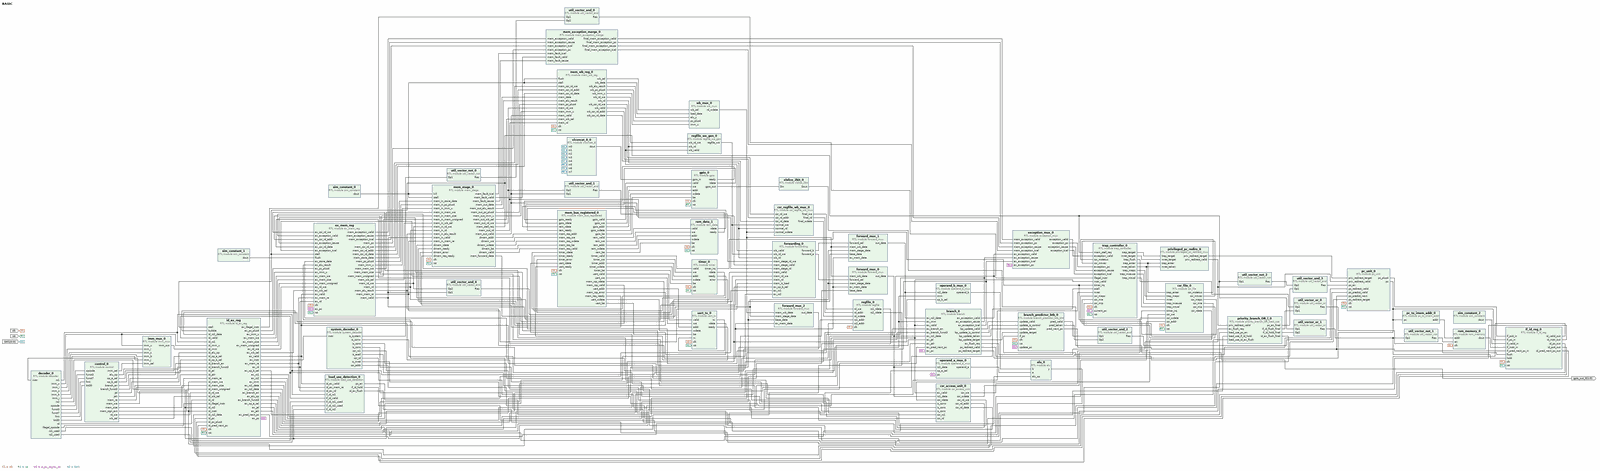
[diagram p0: block diagram of the top level, whole]
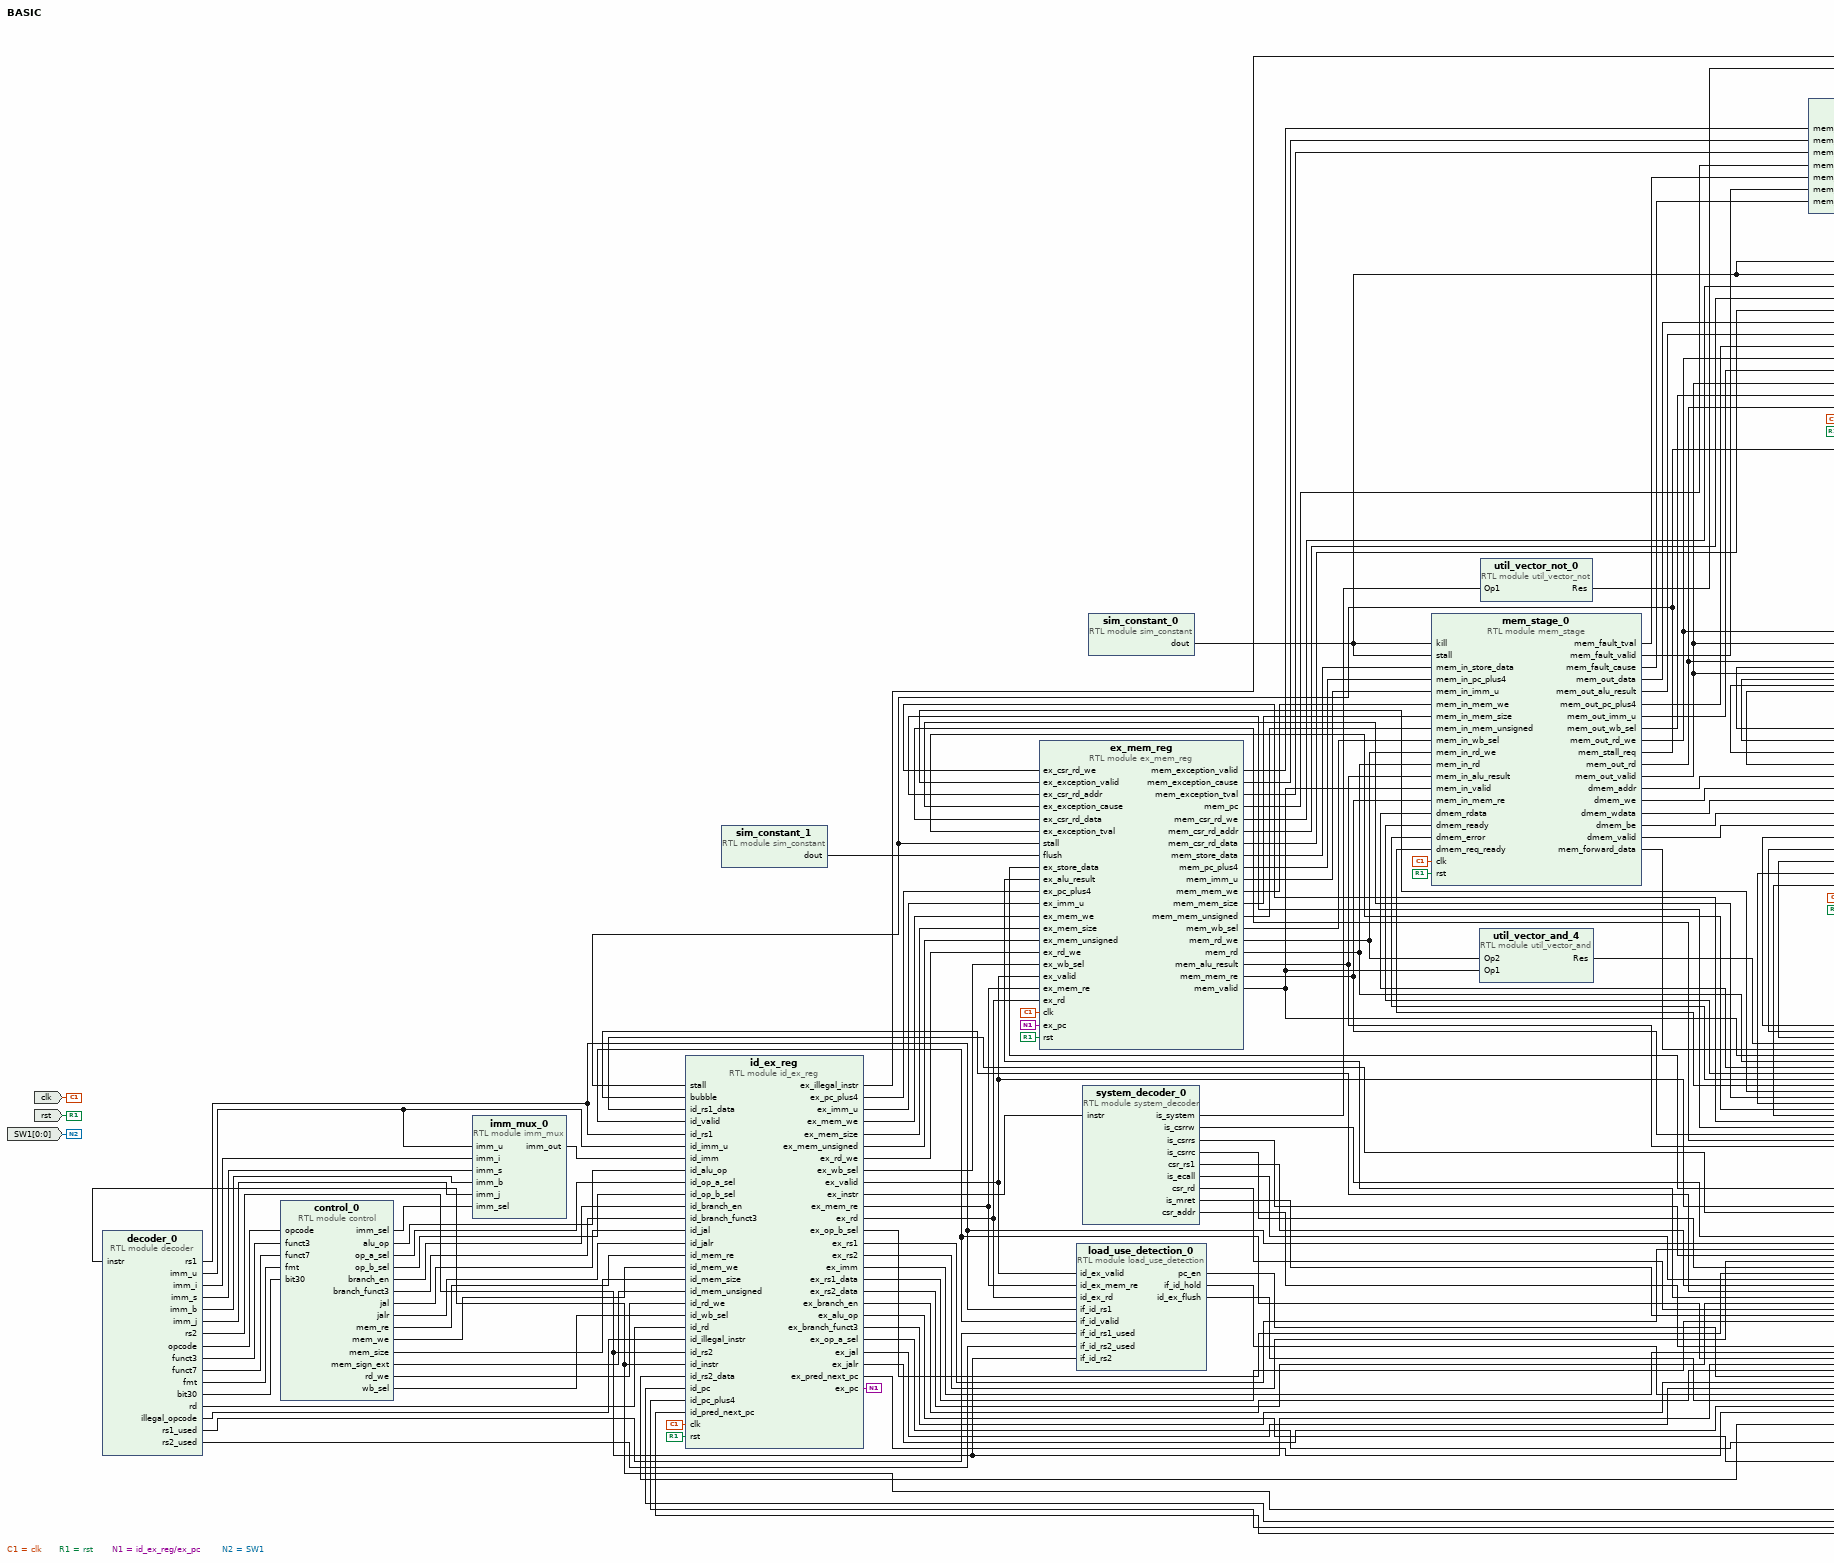
[diagram p1: block diagram of the top level, left part]
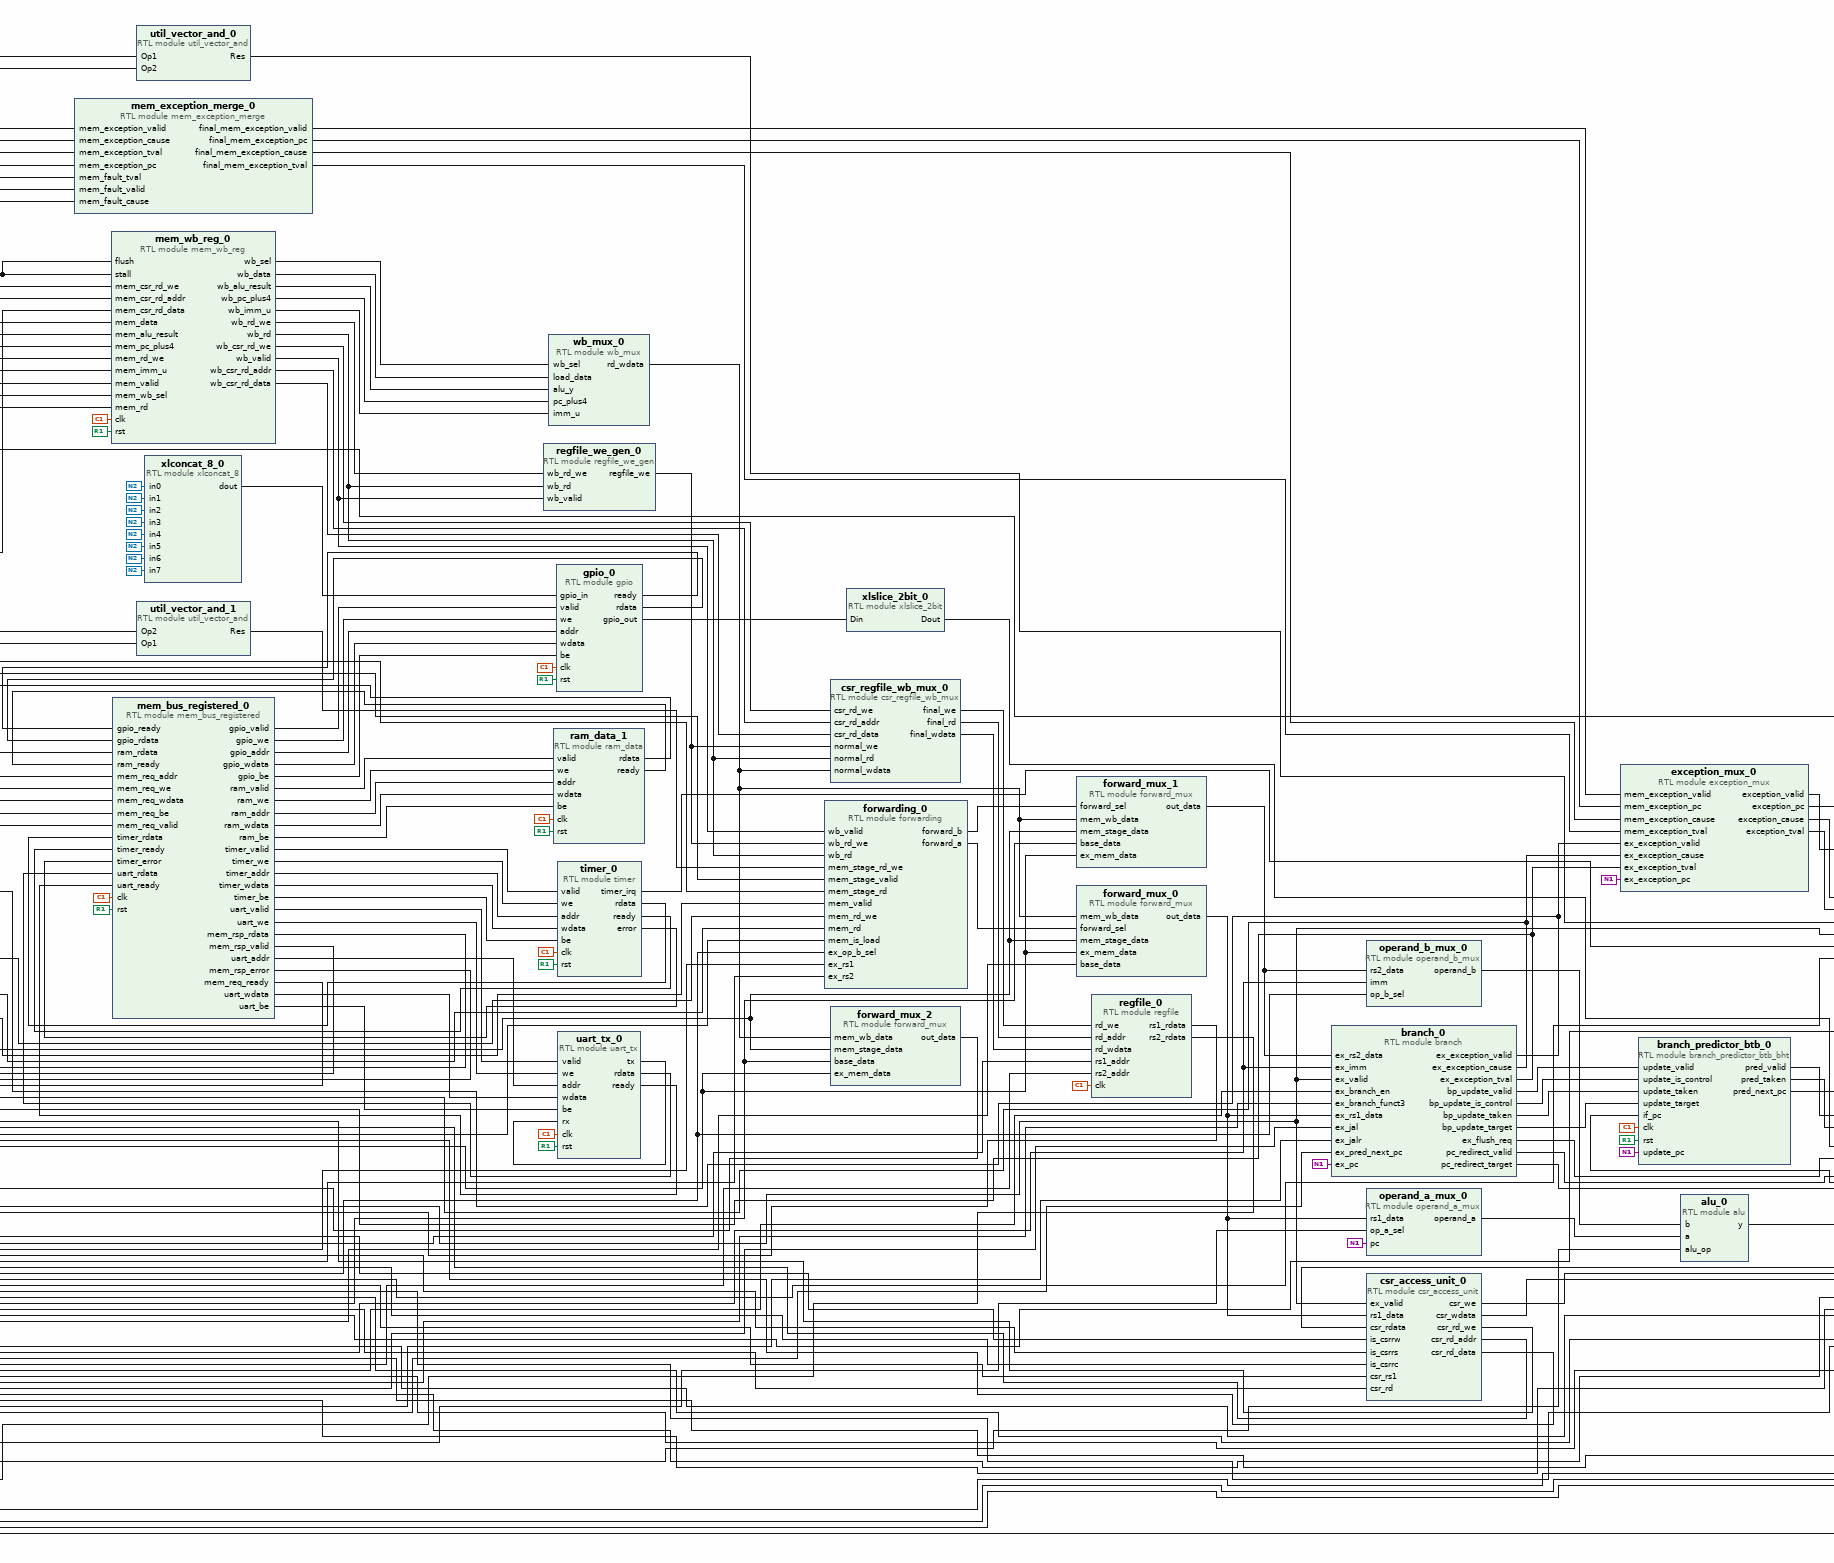
[diagram p2: block diagram of the top level, centre part]
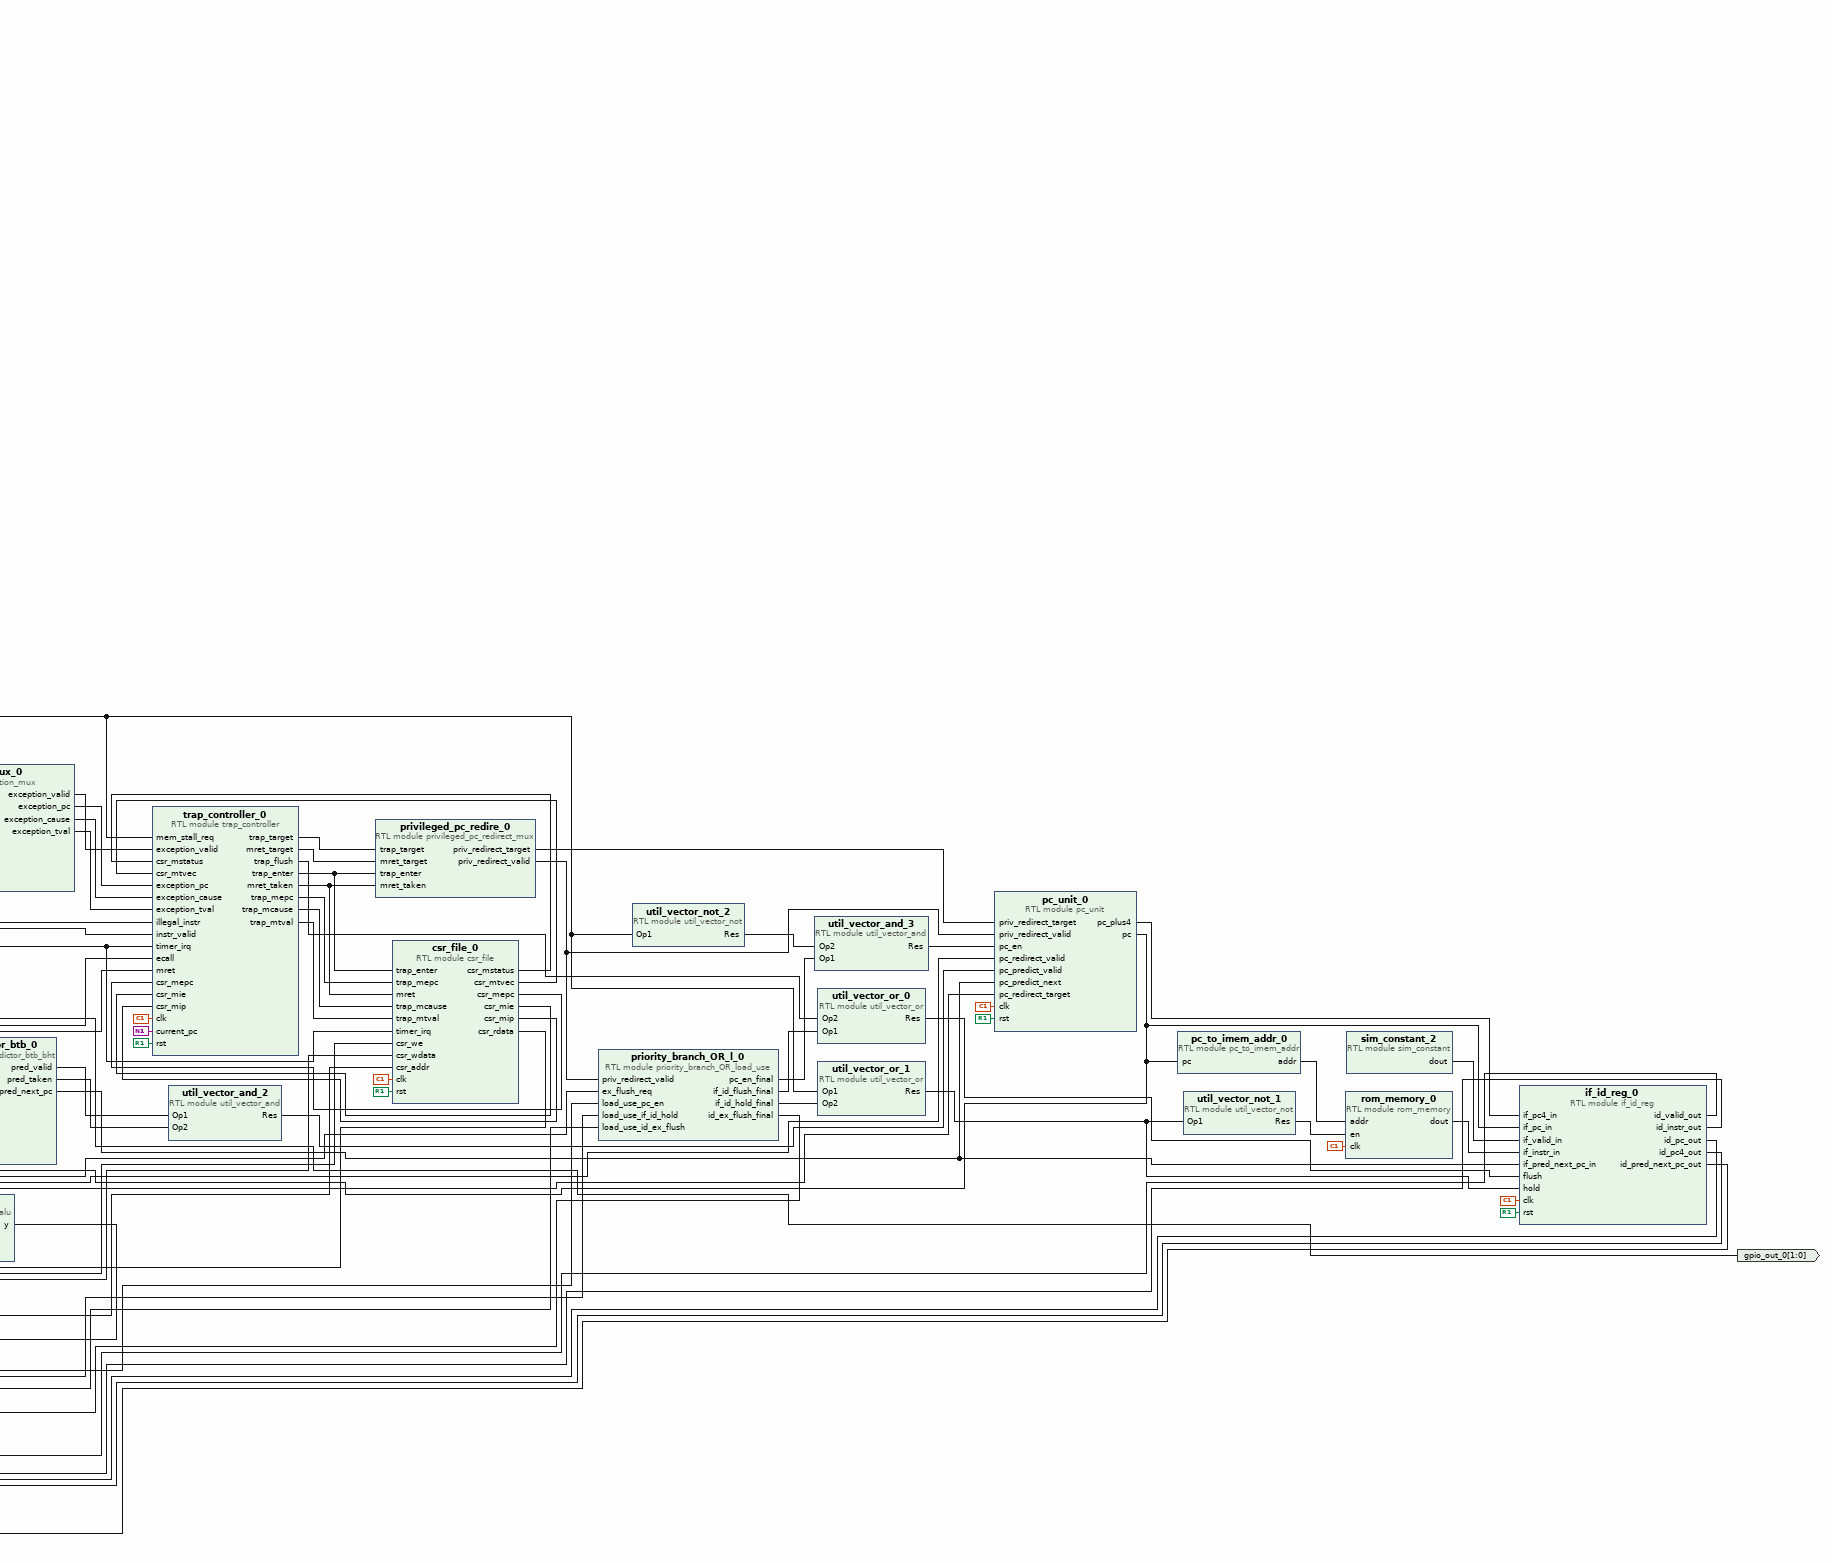
[diagram p3: block diagram of the top level, right part]
# Vivado block design BASIC, xczu5ev-sfvc784-2-i, Vivado 2020.1
create_bd_design BASIC

create_bd_port -dir O -from 1 -to 0 gpio_out_0
create_bd_port -dir I -from 0 -to 0 SW1
create_bd_port -dir I -type clk clk
set_property -dict {CONFIG.FREQ_HZ 100000000} [get_bd_ports clk]
create_bd_port -dir I rst

create_bd_cell -type module -reference xlslice_2bit xlslice_2bit_0
create_bd_cell -type module -reference xlconcat_8 xlconcat_8_0
create_bd_cell -type module -reference uart_tx uart_tx_0
set_property -dict {CONFIG.BAUD 115200 CONFIG.CLK_FREQ 190474289} [get_bd_cells uart_tx_0]
create_bd_cell -type module -reference timer timer_0
set_property -dict {CONFIG.RESET_CMP 0x0002E7CA} [get_bd_cells timer_0]
create_bd_cell -type module -reference gpio gpio_0
create_bd_cell -type module -reference ram_data ram_data_1
create_bd_cell -type module -reference mem_bus_registered mem_bus_registered_0
create_bd_cell -type module -reference csr_access_unit csr_access_unit_0
create_bd_cell -type module -reference privileged_pc_redirect_mux privileged_pc_redire_0
create_bd_cell -type module -reference system_decoder system_decoder_0
create_bd_cell -type module -reference csr_file csr_file_0
create_bd_cell -type module -reference csr_regfile_wb_mux csr_regfile_wb_mux_0
create_bd_cell -type module -reference trap_controller trap_controller_0
create_bd_cell -type module -reference exception_mux exception_mux_0
create_bd_cell -type module -reference mem_exception_merge mem_exception_merge_0
create_bd_cell -type module -reference util_vector_and util_vector_and_0
create_bd_cell -type module -reference util_vector_not util_vector_not_0
create_bd_cell -type module -reference load_use_detection load_use_detection_0
create_bd_cell -type module -reference priority_branch_OR_load_use priority_branch_OR_l_0
create_bd_cell -type module -reference regfile_we_gen regfile_we_gen_0
create_bd_cell -type module -reference mem_wb_reg mem_wb_reg_0
create_bd_cell -type module -reference mem_stage mem_stage_0
create_bd_cell -type module -reference sim_constant sim_constant_0
create_bd_cell -type module -reference alu alu_0
create_bd_cell -type module -reference operand_b_mux operand_b_mux_0
create_bd_cell -type module -reference operand_a_mux operand_a_mux_0
create_bd_cell -type module -reference forward_mux forward_mux_0
create_bd_cell -type module -reference forward_mux forward_mux_1
create_bd_cell -type module -reference forward_mux forward_mux_2
create_bd_cell -type module -reference forwarding forwarding_0
create_bd_cell -type module -reference branch branch_0
create_bd_cell -type module -reference ex_mem_reg ex_mem_reg
create_bd_cell -type module -reference sim_constant sim_constant_1
create_bd_cell -type module -reference util_vector_and util_vector_and_4
create_bd_cell -type module -reference util_vector_and util_vector_and_1
create_bd_cell -type module -reference regfile regfile_0
create_bd_cell -type module -reference imm_mux imm_mux_0
create_bd_cell -type module -reference id_ex_reg id_ex_reg
create_bd_cell -type module -reference decoder decoder_0
create_bd_cell -type module -reference control control_0
create_bd_cell -type module -reference pc_to_imem_addr pc_to_imem_addr_0
set_property -dict {CONFIG.ADDR_W 11} [get_bd_cells pc_to_imem_addr_0]
create_bd_cell -type module -reference branch_predictor_btb_bht branch_predictor_btb_0
create_bd_cell -type module -reference pc_unit pc_unit_0
create_bd_cell -type module -reference util_vector_or util_vector_or_0
create_bd_cell -type module -reference util_vector_or util_vector_or_1
create_bd_cell -type module -reference util_vector_and util_vector_and_2
create_bd_cell -type module -reference util_vector_not util_vector_not_2
create_bd_cell -type module -reference util_vector_not util_vector_not_1
create_bd_cell -type module -reference util_vector_and util_vector_and_3
create_bd_cell -type module -reference rom_memory rom_memory_0
create_bd_cell -type module -reference wb_mux wb_mux_0
create_bd_cell -type module -reference sim_constant sim_constant_2
set_property -dict {CONFIG.VALUE 1} [get_bd_cells sim_constant_2]
create_bd_cell -type module -reference if_id_reg if_id_reg_0

# ---- connections ----

connect_bd_net -net zynq_ultra_ps_e_0_pl_clk0 [get_bd_ports clk] \
  [get_bd_pins uart_tx_0/clk] [get_bd_pins timer_0/clk] [get_bd_pins gpio_0/clk] [get_bd_pins ram_data_1/clk] \
  [get_bd_pins mem_bus_registered_0/clk] [get_bd_pins csr_file_0/clk] [get_bd_pins trap_controller_0/clk] \
  [get_bd_pins mem_wb_reg_0/clk] [get_bd_pins mem_stage_0/clk] [get_bd_pins ex_mem_reg/clk] [get_bd_pins regfile_0/clk] \
  [get_bd_pins id_ex_reg/clk] [get_bd_pins branch_predictor_btb_0/clk] [get_bd_pins pc_unit_0/clk] \
  [get_bd_pins rom_memory_0/clk] [get_bd_pins if_id_reg_0/clk]
connect_bd_net -net proc_sys_reset_0_peripheral_reset [get_bd_ports rst] \
  [get_bd_pins uart_tx_0/rst] [get_bd_pins timer_0/rst] [get_bd_pins gpio_0/rst] [get_bd_pins ram_data_1/rst] \
  [get_bd_pins mem_bus_registered_0/rst] [get_bd_pins csr_file_0/rst] [get_bd_pins trap_controller_0/rst] \
  [get_bd_pins mem_wb_reg_0/rst] [get_bd_pins mem_stage_0/rst] [get_bd_pins ex_mem_reg/rst] [get_bd_pins id_ex_reg/rst] \
  [get_bd_pins branch_predictor_btb_0/rst] [get_bd_pins pc_unit_0/rst] [get_bd_pins if_id_reg_0/rst]
connect_bd_net -net RV32I_MEM_dmem_addr [get_bd_pins mem_stage_0/dmem_addr] [get_bd_pins mem_bus_registered_0/mem_req_addr]
connect_bd_net -net RV32I_MEM_dmem_we [get_bd_pins mem_stage_0/dmem_we] [get_bd_pins mem_bus_registered_0/mem_req_we]
connect_bd_net -net RV32I_MEM_dmem_wdata [get_bd_pins mem_stage_0/dmem_wdata] [get_bd_pins mem_bus_registered_0/mem_req_wdata]
connect_bd_net -net RV32I_MEM_dmem_be [get_bd_pins mem_stage_0/dmem_be] [get_bd_pins mem_bus_registered_0/mem_req_be]
connect_bd_net -net RV32I_RAM_MEMORY_rdata [get_bd_pins ram_data_1/rdata] [get_bd_pins mem_bus_registered_0/ram_rdata]
connect_bd_net [get_bd_pins gpio_0/gpio_out] [get_bd_pins xlslice_2bit_0/Din]
connect_bd_net [get_bd_pins uart_tx_0/rdata] [get_bd_pins mem_bus_registered_0/uart_rdata]
connect_bd_net [get_bd_pins gpio_0/ready] [get_bd_pins mem_bus_registered_0/gpio_ready]
connect_bd_net [get_bd_pins gpio_0/rdata] [get_bd_pins mem_bus_registered_0/gpio_rdata]
connect_bd_net [get_bd_pins timer_0/rdata] [get_bd_pins mem_bus_registered_0/timer_rdata]
connect_bd_net [get_bd_pins timer_0/ready] [get_bd_pins mem_bus_registered_0/timer_ready]
connect_bd_net -net mem_data_1 [get_bd_pins mem_bus_registered_0/mem_rsp_rdata] [get_bd_pins mem_stage_0/dmem_rdata]
connect_bd_net -net MMIO_ram_valid [get_bd_pins mem_bus_registered_0/ram_valid] [get_bd_pins ram_data_1/valid]
connect_bd_net -net we_1 [get_bd_pins mem_bus_registered_0/ram_we] [get_bd_pins ram_data_1/we]
connect_bd_net -net addr_1 [get_bd_pins mem_bus_registered_0/ram_addr] [get_bd_pins ram_data_1/addr]
connect_bd_net -net wdata_1 [get_bd_pins mem_bus_registered_0/ram_wdata] [get_bd_pins ram_data_1/wdata]
connect_bd_net -net be_1 [get_bd_pins mem_bus_registered_0/ram_be] [get_bd_pins ram_data_1/be]
connect_bd_net -net valid_1 [get_bd_pins mem_bus_registered_0/gpio_valid] [get_bd_pins gpio_0/valid]
connect_bd_net -net we_2 [get_bd_pins mem_bus_registered_0/gpio_we] [get_bd_pins gpio_0/we]
connect_bd_net -net addr_2 [get_bd_pins mem_bus_registered_0/gpio_addr] [get_bd_pins gpio_0/addr]
connect_bd_net -net wdata_2 [get_bd_pins mem_bus_registered_0/gpio_wdata] [get_bd_pins gpio_0/wdata]
connect_bd_net -net be_2 [get_bd_pins mem_bus_registered_0/gpio_be] [get_bd_pins gpio_0/be]
connect_bd_net -net valid_2 [get_bd_pins mem_bus_registered_0/uart_valid] [get_bd_pins uart_tx_0/valid]
connect_bd_net -net we_3 [get_bd_pins mem_bus_registered_0/uart_we] [get_bd_pins uart_tx_0/we]
connect_bd_net -net addr_3 [get_bd_pins mem_bus_registered_0/uart_addr] [get_bd_pins uart_tx_0/addr]
connect_bd_net -net wdata_3 [get_bd_pins mem_bus_registered_0/uart_wdata] [get_bd_pins uart_tx_0/wdata]
connect_bd_net -net be_3 [get_bd_pins mem_bus_registered_0/uart_be] [get_bd_pins uart_tx_0/be]
connect_bd_net -net valid_3 [get_bd_pins mem_bus_registered_0/timer_valid] [get_bd_pins timer_0/valid]
connect_bd_net -net we_4 [get_bd_pins mem_bus_registered_0/timer_we] [get_bd_pins timer_0/we]
connect_bd_net -net addr_4 [get_bd_pins mem_bus_registered_0/timer_addr] [get_bd_pins timer_0/addr]
connect_bd_net -net wdata_4 [get_bd_pins mem_bus_registered_0/timer_wdata] [get_bd_pins timer_0/wdata]
connect_bd_net -net be_4 [get_bd_pins mem_bus_registered_0/timer_be] [get_bd_pins timer_0/be]
connect_bd_net -net ram_ready_1 [get_bd_pins ram_data_1/ready] [get_bd_pins mem_bus_registered_0/ram_ready]
connect_bd_net -net dmem_ready_1 [get_bd_pins mem_bus_registered_0/mem_rsp_valid] [get_bd_pins mem_stage_0/dmem_ready]
connect_bd_net [get_bd_pins uart_tx_0/ready] [get_bd_pins mem_bus_registered_0/uart_ready]
connect_bd_net -net Core_RV32I_ex_instr [get_bd_pins id_ex_reg/ex_instr] [get_bd_pins system_decoder_0/instr]
connect_bd_net -net Core_RV32I_mem_stall_req [get_bd_pins mem_stage_0/mem_stall_req] \
  [get_bd_pins trap_controller_0/mem_stall_req] [get_bd_pins ex_mem_reg/stall] [get_bd_pins id_ex_reg/stall] \
  [get_bd_pins util_vector_or_1/Op1] [get_bd_pins util_vector_not_2/Op1]
connect_bd_net -net Core_RV32I_ex_illegal_instr [get_bd_pins id_ex_reg/ex_illegal_instr] [get_bd_pins util_vector_and_0/Op1]
connect_bd_net [get_bd_pins privileged_pc_redire_0/priv_redirect_valid] \
  [get_bd_pins priority_branch_OR_l_0/priv_redirect_valid] [get_bd_pins pc_unit_0/priv_redirect_valid]
connect_bd_net [get_bd_pins csr_regfile_wb_mux_0/final_we] [get_bd_pins regfile_0/rd_we]
connect_bd_net [get_bd_pins csr_regfile_wb_mux_0/final_rd] [get_bd_pins regfile_0/rd_addr]
connect_bd_net [get_bd_pins csr_regfile_wb_mux_0/final_wdata] [get_bd_pins regfile_0/rd_wdata]
connect_bd_net -net Core_RV32I_wb_rd [get_bd_pins mem_wb_reg_0/wb_rd] \
  [get_bd_pins csr_regfile_wb_mux_0/normal_rd] [get_bd_pins regfile_we_gen_0/wb_rd] [get_bd_pins forwarding_0/wb_rd]
connect_bd_net -net Core_RV32I_rd_wdata1 [get_bd_pins wb_mux_0/rd_wdata] \
  [get_bd_pins csr_regfile_wb_mux_0/normal_wdata] [get_bd_pins forward_mux_1/mem_wb_data] \
  [get_bd_pins forward_mux_0/mem_wb_data] [get_bd_pins forward_mux_2/mem_wb_data]
connect_bd_net -net Core_RV32I_out_data [get_bd_pins forward_mux_0/out_data] \
  [get_bd_pins csr_access_unit_0/rs1_data] [get_bd_pins operand_a_mux_0/rs1_data] [get_bd_pins branch_0/ex_rs1_data]
connect_bd_net -net Core_RV32I_ex_pc [get_bd_pins id_ex_reg/ex_pc] \
  [get_bd_pins trap_controller_0/current_pc] [get_bd_pins exception_mux_0/ex_exception_pc] [get_bd_pins operand_a_mux_0/pc] \
  [get_bd_pins branch_0/ex_pc] [get_bd_pins ex_mem_reg/ex_pc] [get_bd_pins branch_predictor_btb_0/update_pc]
connect_bd_net -net Core_RV32I_ex_valid [get_bd_pins id_ex_reg/ex_valid] \
  [get_bd_pins csr_access_unit_0/ex_valid] [get_bd_pins trap_controller_0/instr_valid] \
  [get_bd_pins load_use_detection_0/id_ex_valid] [get_bd_pins branch_0/ex_valid] [get_bd_pins ex_mem_reg/ex_valid]
connect_bd_net [get_bd_pins trap_controller_0/trap_flush] [get_bd_pins util_vector_or_0/Op2]
connect_bd_net [get_bd_pins privileged_pc_redire_0/priv_redirect_target] [get_bd_pins pc_unit_0/priv_redirect_target]
connect_bd_net -net MMIO_mem_rsp_error [get_bd_pins mem_bus_registered_0/mem_rsp_error] [get_bd_pins mem_stage_0/dmem_error]
connect_bd_net -net Core_RV32I_regfile_we [get_bd_pins regfile_we_gen_0/regfile_we] \
  [get_bd_pins csr_regfile_wb_mux_0/normal_we] [get_bd_pins forwarding_0/wb_rd_we]
connect_bd_net -net mem_req_valid_1 [get_bd_pins mem_stage_0/dmem_valid] [get_bd_pins mem_bus_registered_0/mem_req_valid]
connect_bd_net -net dmem_req_ready_1 [get_bd_pins mem_bus_registered_0/mem_req_ready] [get_bd_pins mem_stage_0/dmem_req_ready]
connect_bd_net -net PRIVILEGED_csr_rd_we [get_bd_pins csr_access_unit_0/csr_rd_we] [get_bd_pins ex_mem_reg/ex_csr_rd_we]
connect_bd_net -net ex_csr_rd_addr_1 [get_bd_pins csr_access_unit_0/csr_rd_addr] [get_bd_pins ex_mem_reg/ex_csr_rd_addr]
connect_bd_net -net PRIVILEGED_csr_rd_data1 [get_bd_pins csr_access_unit_0/csr_rd_data] [get_bd_pins ex_mem_reg/ex_csr_rd_data]
connect_bd_net -net Core_RV32I_wb_csr_rd_we [get_bd_pins mem_wb_reg_0/wb_csr_rd_we] [get_bd_pins csr_regfile_wb_mux_0/csr_rd_we]
connect_bd_net -net csr_rd_addr1_1 [get_bd_pins mem_wb_reg_0/wb_csr_rd_addr] [get_bd_pins csr_regfile_wb_mux_0/csr_rd_addr]
connect_bd_net -net Core_RV32I_wb_csr_rd_data [get_bd_pins mem_wb_reg_0/wb_csr_rd_data] [get_bd_pins csr_regfile_wb_mux_0/csr_rd_data]
connect_bd_net -net Core_RV32I_ex_exception_valid [get_bd_pins branch_0/ex_exception_valid] \
  [get_bd_pins exception_mux_0/ex_exception_valid] [get_bd_pins ex_mem_reg/ex_exception_valid]
connect_bd_net -net Core_RV32I_ex_exception_cause [get_bd_pins branch_0/ex_exception_cause] \
  [get_bd_pins exception_mux_0/ex_exception_cause] [get_bd_pins ex_mem_reg/ex_exception_cause]
connect_bd_net -net Core_RV32I_ex_exception_tval [get_bd_pins branch_0/ex_exception_tval] \
  [get_bd_pins exception_mux_0/ex_exception_tval] [get_bd_pins ex_mem_reg/ex_exception_tval]
connect_bd_net -net Core_RV32I_mem_fault_tval [get_bd_pins mem_stage_0/mem_fault_tval] [get_bd_pins mem_exception_merge_0/mem_fault_tval]
connect_bd_net -net Core_RV32I_mem_fault_valid [get_bd_pins mem_stage_0/mem_fault_valid] [get_bd_pins mem_exception_merge_0/mem_fault_valid]
connect_bd_net -net Core_RV32I_mem_fault_cause [get_bd_pins mem_stage_0/mem_fault_cause] [get_bd_pins mem_exception_merge_0/mem_fault_cause]
connect_bd_net -net Core_RV32I_mem_exception_valid [get_bd_pins ex_mem_reg/mem_exception_valid] \
  [get_bd_pins mem_exception_merge_0/mem_exception_valid]
connect_bd_net -net Core_RV32I_mem_exception_cause [get_bd_pins ex_mem_reg/mem_exception_cause] \
  [get_bd_pins mem_exception_merge_0/mem_exception_cause]
connect_bd_net -net Core_RV32I_mem_exception_tval [get_bd_pins ex_mem_reg/mem_exception_tval] [get_bd_pins mem_exception_merge_0/mem_exception_tval]
connect_bd_net -net Core_RV32I_mem_pc [get_bd_pins ex_mem_reg/mem_pc] [get_bd_pins mem_exception_merge_0/mem_exception_pc]
connect_bd_net -net timer_irq_1 [get_bd_pins timer_0/timer_irq] [get_bd_pins csr_file_0/timer_irq] [get_bd_pins trap_controller_0/timer_irq]
connect_bd_net -net timer_error_1 [get_bd_pins timer_0/error] [get_bd_pins mem_bus_registered_0/timer_error]
connect_bd_net -net xlconstant_1_dout [get_bd_ports SW1] \
  [get_bd_pins xlconcat_8_0/in0] [get_bd_pins xlconcat_8_0/in1] [get_bd_pins xlconcat_8_0/in2] [get_bd_pins xlconcat_8_0/in3] \
  [get_bd_pins xlconcat_8_0/in4] [get_bd_pins xlconcat_8_0/in5] [get_bd_pins xlconcat_8_0/in6] [get_bd_pins xlconcat_8_0/in7]
connect_bd_net [get_bd_pins xlconcat_8_0/dout] [get_bd_pins gpio_0/gpio_in]
connect_bd_net [get_bd_pins xlslice_2bit_0/Dout] [get_bd_ports gpio_out_0]
connect_bd_net [get_bd_pins system_decoder_0/is_csrrw] [get_bd_pins csr_access_unit_0/is_csrrw]
connect_bd_net [get_bd_pins system_decoder_0/is_csrrs] [get_bd_pins csr_access_unit_0/is_csrrs]
connect_bd_net [get_bd_pins system_decoder_0/is_csrrc] [get_bd_pins csr_access_unit_0/is_csrrc]
connect_bd_net [get_bd_pins system_decoder_0/csr_rs1] [get_bd_pins csr_access_unit_0/csr_rs1]
connect_bd_net [get_bd_pins system_decoder_0/csr_rd] [get_bd_pins csr_access_unit_0/csr_rd]
connect_bd_net [get_bd_pins csr_file_0/csr_rdata] [get_bd_pins csr_access_unit_0/csr_rdata]
connect_bd_net [get_bd_pins csr_access_unit_0/csr_we] [get_bd_pins csr_file_0/csr_we]
connect_bd_net [get_bd_pins csr_access_unit_0/csr_wdata] [get_bd_pins csr_file_0/csr_wdata]
connect_bd_net [get_bd_pins trap_controller_0/trap_enter] [get_bd_pins privileged_pc_redire_0/trap_enter] [get_bd_pins csr_file_0/trap_enter]
connect_bd_net [get_bd_pins trap_controller_0/trap_target] [get_bd_pins privileged_pc_redire_0/trap_target]
connect_bd_net [get_bd_pins trap_controller_0/mret_taken] [get_bd_pins privileged_pc_redire_0/mret_taken] [get_bd_pins csr_file_0/mret]
connect_bd_net [get_bd_pins trap_controller_0/mret_target] [get_bd_pins privileged_pc_redire_0/mret_target]
connect_bd_net [get_bd_pins system_decoder_0/is_system] [get_bd_pins util_vector_not_0/Op1]
connect_bd_net [get_bd_pins system_decoder_0/is_ecall] [get_bd_pins trap_controller_0/ecall]
connect_bd_net [get_bd_pins system_decoder_0/is_mret] [get_bd_pins trap_controller_0/mret]
connect_bd_net [get_bd_pins system_decoder_0/csr_addr] [get_bd_pins csr_file_0/csr_addr]
connect_bd_net [get_bd_pins trap_controller_0/trap_mepc] [get_bd_pins csr_file_0/trap_mepc]
connect_bd_net [get_bd_pins trap_controller_0/trap_mcause] [get_bd_pins csr_file_0/trap_mcause]
connect_bd_net [get_bd_pins trap_controller_0/trap_mtval] [get_bd_pins csr_file_0/trap_mtval]
connect_bd_net [get_bd_pins csr_file_0/csr_mstatus] [get_bd_pins trap_controller_0/csr_mstatus]
connect_bd_net [get_bd_pins csr_file_0/csr_mtvec] [get_bd_pins trap_controller_0/csr_mtvec]
connect_bd_net [get_bd_pins csr_file_0/csr_mepc] [get_bd_pins trap_controller_0/csr_mepc]
connect_bd_net [get_bd_pins csr_file_0/csr_mie] [get_bd_pins trap_controller_0/csr_mie]
connect_bd_net [get_bd_pins csr_file_0/csr_mip] [get_bd_pins trap_controller_0/csr_mip]
connect_bd_net [get_bd_pins exception_mux_0/exception_valid] [get_bd_pins trap_controller_0/exception_valid]
connect_bd_net [get_bd_pins exception_mux_0/exception_pc] [get_bd_pins trap_controller_0/exception_pc]
connect_bd_net [get_bd_pins exception_mux_0/exception_cause] [get_bd_pins trap_controller_0/exception_cause]
connect_bd_net [get_bd_pins exception_mux_0/exception_tval] [get_bd_pins trap_controller_0/exception_tval]
connect_bd_net [get_bd_pins util_vector_and_0/Res] [get_bd_pins trap_controller_0/illegal_instr]
connect_bd_net [get_bd_pins mem_exception_merge_0/final_mem_exception_valid] [get_bd_pins exception_mux_0/mem_exception_valid]
connect_bd_net [get_bd_pins mem_exception_merge_0/final_mem_exception_pc] [get_bd_pins exception_mux_0/mem_exception_pc]
connect_bd_net [get_bd_pins mem_exception_merge_0/final_mem_exception_cause] [get_bd_pins exception_mux_0/mem_exception_cause]
connect_bd_net [get_bd_pins mem_exception_merge_0/final_mem_exception_tval] [get_bd_pins exception_mux_0/mem_exception_tval]
connect_bd_net [get_bd_pins util_vector_not_0/Res] [get_bd_pins util_vector_and_0/Op2]
connect_bd_net -net RV32I_MEM_wb_sel [get_bd_pins mem_wb_reg_0/wb_sel] [get_bd_pins wb_mux_0/wb_sel]
connect_bd_net -net RV32I_MEM_wb_data [get_bd_pins mem_wb_reg_0/wb_data] [get_bd_pins wb_mux_0/load_data]
connect_bd_net -net RV32I_MEM_wb_alu_result [get_bd_pins mem_wb_reg_0/wb_alu_result] [get_bd_pins wb_mux_0/alu_y]
connect_bd_net -net RV32I_MEM_wb_pc_plus4 [get_bd_pins mem_wb_reg_0/wb_pc_plus4] [get_bd_pins wb_mux_0/pc_plus4]
connect_bd_net -net RV32I_MEM_wb_imm_u [get_bd_pins mem_wb_reg_0/wb_imm_u] [get_bd_pins wb_mux_0/imm_u]
connect_bd_net -net ex_mem_re_1 [get_bd_pins id_ex_reg/ex_mem_re] [get_bd_pins load_use_detection_0/id_ex_mem_re] [get_bd_pins ex_mem_reg/ex_mem_re]
connect_bd_net -net RV32I_ID_ex_rd [get_bd_pins id_ex_reg/ex_rd] [get_bd_pins load_use_detection_0/id_ex_rd] [get_bd_pins ex_mem_reg/ex_rd]
connect_bd_net -net RV32I_IF_id_valid_out [get_bd_pins if_id_reg_0/id_valid_out] \
  [get_bd_pins load_use_detection_0/if_id_valid] [get_bd_pins id_ex_reg/id_valid]
connect_bd_net -net RV32I_ID_rs1 [get_bd_pins decoder_0/rs1] \
  [get_bd_pins load_use_detection_0/if_id_rs1] [get_bd_pins regfile_0/rs1_addr] [get_bd_pins id_ex_reg/id_rs1]
connect_bd_net -net RV32I_ID_rs2 [get_bd_pins decoder_0/rs2] \
  [get_bd_pins load_use_detection_0/if_id_rs2] [get_bd_pins regfile_0/rs2_addr] [get_bd_pins id_ex_reg/id_rs2]
connect_bd_net -net RV32I_ID_rs1_used [get_bd_pins decoder_0/rs1_used] [get_bd_pins load_use_detection_0/if_id_rs1_used]
connect_bd_net -net RV32I_ID_rs2_used [get_bd_pins decoder_0/rs2_used] [get_bd_pins load_use_detection_0/if_id_rs2_used]
connect_bd_net [get_bd_pins load_use_detection_0/pc_en] [get_bd_pins priority_branch_OR_l_0/load_use_pc_en]
connect_bd_net [get_bd_pins load_use_detection_0/if_id_hold] [get_bd_pins priority_branch_OR_l_0/load_use_if_id_hold]
connect_bd_net [get_bd_pins load_use_detection_0/id_ex_flush] [get_bd_pins priority_branch_OR_l_0/load_use_id_ex_flush]
connect_bd_net -net RV32I_EX_ex_flush_req [get_bd_pins branch_0/ex_flush_req] [get_bd_pins priority_branch_OR_l_0/ex_flush_req]
connect_bd_net -net pc_en_1 [get_bd_pins priority_branch_OR_l_0/pc_en_final] [get_bd_pins util_vector_and_3/Op1]
connect_bd_net -net hold_1 [get_bd_pins priority_branch_OR_l_0/if_id_hold_final] [get_bd_pins util_vector_or_1/Op2]
connect_bd_net -net flush_1 [get_bd_pins priority_branch_OR_l_0/if_id_flush_final] [get_bd_pins util_vector_or_0/Op1]
connect_bd_net -net bubble_1 [get_bd_pins priority_branch_OR_l_0/id_ex_flush_final] [get_bd_pins id_ex_reg/bubble]
connect_bd_net -net RV32I_MEM_wb_valid [get_bd_pins mem_wb_reg_0/wb_valid] [get_bd_pins regfile_we_gen_0/wb_valid] [get_bd_pins forwarding_0/wb_valid]
connect_bd_net [get_bd_pins mem_wb_reg_0/wb_rd_we] [get_bd_pins regfile_we_gen_0/wb_rd_we]
connect_bd_net -net xlconstant_3_dout [get_bd_pins sim_constant_0/dout] \
  [get_bd_pins mem_wb_reg_0/stall] [get_bd_pins mem_wb_reg_0/flush] [get_bd_pins mem_stage_0/stall] \
  [get_bd_pins mem_stage_0/kill]
connect_bd_net [get_bd_pins mem_stage_0/mem_out_valid] \
  [get_bd_pins mem_wb_reg_0/mem_valid] [get_bd_pins forwarding_0/mem_stage_valid] [get_bd_pins util_vector_and_1/Op1]
connect_bd_net [get_bd_pins mem_stage_0/mem_out_data] [get_bd_pins mem_wb_reg_0/mem_data]
connect_bd_net [get_bd_pins mem_stage_0/mem_out_alu_result] [get_bd_pins mem_wb_reg_0/mem_alu_result]
connect_bd_net [get_bd_pins mem_stage_0/mem_out_pc_plus4] [get_bd_pins mem_wb_reg_0/mem_pc_plus4]
connect_bd_net [get_bd_pins mem_stage_0/mem_out_imm_u] [get_bd_pins mem_wb_reg_0/mem_imm_u]
connect_bd_net [get_bd_pins mem_stage_0/mem_out_rd] [get_bd_pins mem_wb_reg_0/mem_rd] [get_bd_pins forwarding_0/mem_stage_rd]
connect_bd_net -net RV32I_MEM_mem_rd_we [get_bd_pins mem_stage_0/mem_out_rd_we] \
  [get_bd_pins mem_wb_reg_0/mem_rd_we] [get_bd_pins util_vector_and_1/Op2]
connect_bd_net [get_bd_pins mem_stage_0/mem_out_wb_sel] [get_bd_pins mem_wb_reg_0/mem_wb_sel]
connect_bd_net -net RV32I_EX_mem_csr_rd_we [get_bd_pins ex_mem_reg/mem_csr_rd_we] [get_bd_pins mem_wb_reg_0/mem_csr_rd_we]
connect_bd_net -net mem_csr_rd_addr_1 [get_bd_pins ex_mem_reg/mem_csr_rd_addr] [get_bd_pins mem_wb_reg_0/mem_csr_rd_addr]
connect_bd_net -net RV32I_EX_mem_csr_rd_data [get_bd_pins ex_mem_reg/mem_csr_rd_data] [get_bd_pins mem_wb_reg_0/mem_csr_rd_data]
connect_bd_net -net ex_mem_reg_1_mem_valid [get_bd_pins ex_mem_reg/mem_valid] \
  [get_bd_pins mem_stage_0/mem_in_valid] [get_bd_pins forwarding_0/mem_valid] [get_bd_pins util_vector_and_4/Op1]
connect_bd_net -net ex_mem_reg_1_mem_alu_result [get_bd_pins ex_mem_reg/mem_alu_result] \
  [get_bd_pins mem_stage_0/mem_in_alu_result] [get_bd_pins forward_mux_0/ex_mem_data] [get_bd_pins forward_mux_1/ex_mem_data] \
  [get_bd_pins forward_mux_2/ex_mem_data]
connect_bd_net -net ex_mem_reg_1_mem_store_data [get_bd_pins ex_mem_reg/mem_store_data] [get_bd_pins mem_stage_0/mem_in_store_data]
connect_bd_net -net ex_mem_reg_1_mem_pc_plus4 [get_bd_pins ex_mem_reg/mem_pc_plus4] [get_bd_pins mem_stage_0/mem_in_pc_plus4]
connect_bd_net -net ex_mem_reg_1_mem_imm_u [get_bd_pins ex_mem_reg/mem_imm_u] [get_bd_pins mem_stage_0/mem_in_imm_u]
connect_bd_net -net ex_mem_reg_1_mem_rd [get_bd_pins ex_mem_reg/mem_rd] [get_bd_pins mem_stage_0/mem_in_rd] [get_bd_pins forwarding_0/mem_rd]
connect_bd_net -net ex_mem_reg_1_mem_mem_re [get_bd_pins ex_mem_reg/mem_mem_re] \
  [get_bd_pins mem_stage_0/mem_in_mem_re] [get_bd_pins forwarding_0/mem_is_load]
connect_bd_net -net ex_mem_reg_1_mem_mem_we [get_bd_pins ex_mem_reg/mem_mem_we] [get_bd_pins mem_stage_0/mem_in_mem_we]
connect_bd_net -net ex_mem_reg_1_mem_mem_size [get_bd_pins ex_mem_reg/mem_mem_size] [get_bd_pins mem_stage_0/mem_in_mem_size]
connect_bd_net -net ex_mem_reg_1_mem_mem_unsigned [get_bd_pins ex_mem_reg/mem_mem_unsigned] [get_bd_pins mem_stage_0/mem_in_mem_unsigned]
connect_bd_net -net ex_mem_reg_1_mem_rd_we [get_bd_pins ex_mem_reg/mem_rd_we] \
  [get_bd_pins mem_stage_0/mem_in_rd_we] [get_bd_pins util_vector_and_4/Op2]
connect_bd_net -net ex_mem_reg_1_mem_wb_sel [get_bd_pins ex_mem_reg/mem_wb_sel] [get_bd_pins mem_stage_0/mem_in_wb_sel]
connect_bd_net [get_bd_pins mem_stage_0/mem_forward_data] \
  [get_bd_pins forward_mux_1/mem_stage_data] [get_bd_pins forward_mux_0/mem_stage_data] \
  [get_bd_pins forward_mux_2/mem_stage_data]
connect_bd_net [get_bd_pins operand_a_mux_0/operand_a] [get_bd_pins alu_0/a]
connect_bd_net [get_bd_pins operand_b_mux_0/operand_b] [get_bd_pins alu_0/b]
connect_bd_net -net alu_op_1 [get_bd_pins id_ex_reg/ex_alu_op] [get_bd_pins alu_0/alu_op]
connect_bd_net [get_bd_pins alu_0/y] [get_bd_pins ex_mem_reg/ex_alu_result]
connect_bd_net [get_bd_pins forward_mux_1/out_data] [get_bd_pins operand_b_mux_0/rs2_data] [get_bd_pins branch_0/ex_rs2_data]
connect_bd_net -net ex_imm_1 [get_bd_pins id_ex_reg/ex_imm] [get_bd_pins operand_b_mux_0/imm] [get_bd_pins branch_0/ex_imm]
connect_bd_net -net ex_op_b_sel_1 [get_bd_pins id_ex_reg/ex_op_b_sel] [get_bd_pins operand_b_mux_0/op_b_sel] [get_bd_pins forwarding_0/ex_op_b_sel]
connect_bd_net -net op_a_sel_1 [get_bd_pins id_ex_reg/ex_op_a_sel] [get_bd_pins operand_a_mux_0/op_a_sel]
connect_bd_net -net ex_rs1_data_1 [get_bd_pins id_ex_reg/ex_rs1_data] [get_bd_pins forward_mux_0/base_data]
connect_bd_net [get_bd_pins forwarding_0/forward_a] [get_bd_pins forward_mux_0/forward_sel]
connect_bd_net -net ex_rs2_data_1 [get_bd_pins id_ex_reg/ex_rs2_data] [get_bd_pins forward_mux_1/base_data] [get_bd_pins forward_mux_2/base_data]
connect_bd_net [get_bd_pins forwarding_0/forward_b] [get_bd_pins forward_mux_1/forward_sel]
connect_bd_net [get_bd_pins forward_mux_2/out_data] [get_bd_pins ex_mem_reg/ex_store_data]
connect_bd_net -net ex_rs1_1 [get_bd_pins id_ex_reg/ex_rs1] [get_bd_pins forwarding_0/ex_rs1]
connect_bd_net -net ex_rs2_1 [get_bd_pins id_ex_reg/ex_rs2] [get_bd_pins forwarding_0/ex_rs2]
connect_bd_net -net util_vector_and_0_Res_2 [get_bd_pins util_vector_and_4/Res] [get_bd_pins forwarding_0/mem_rd_we]
connect_bd_net [get_bd_pins util_vector_and_1/Res] [get_bd_pins forwarding_0/mem_stage_rd_we]
connect_bd_net -net ex_branch_en_1 [get_bd_pins id_ex_reg/ex_branch_en] [get_bd_pins branch_0/ex_branch_en]
connect_bd_net -net ex_branch_funct3_1 [get_bd_pins id_ex_reg/ex_branch_funct3] [get_bd_pins branch_0/ex_branch_funct3]
connect_bd_net -net ex_jal_1 [get_bd_pins id_ex_reg/ex_jal] [get_bd_pins branch_0/ex_jal]
connect_bd_net -net ex_jalr_1 [get_bd_pins id_ex_reg/ex_jalr] [get_bd_pins branch_0/ex_jalr]
connect_bd_net -net RV32I_ID_ex_pred_next_pc [get_bd_pins id_ex_reg/ex_pred_next_pc] [get_bd_pins branch_0/ex_pred_next_pc]
connect_bd_net -net RV32I_EX_pc_redirect_valid [get_bd_pins branch_0/pc_redirect_valid] [get_bd_pins pc_unit_0/pc_redirect_valid]
connect_bd_net -net RV32I_EX_pc_redirect_target [get_bd_pins branch_0/pc_redirect_target] [get_bd_pins pc_unit_0/pc_redirect_target]
connect_bd_net -net RV32I_EX_bp_update_valid [get_bd_pins branch_0/bp_update_valid] [get_bd_pins branch_predictor_btb_0/update_valid]
connect_bd_net -net update_is_control_1 [get_bd_pins branch_0/bp_update_is_control] [get_bd_pins branch_predictor_btb_0/update_is_control]
connect_bd_net -net RV32I_EX_bp_update_taken [get_bd_pins branch_0/bp_update_taken] [get_bd_pins branch_predictor_btb_0/update_taken]
connect_bd_net -net RV32I_EX_bp_update_target [get_bd_pins branch_0/bp_update_target] [get_bd_pins branch_predictor_btb_0/update_target]
connect_bd_net -net sim_constant_0_dout [get_bd_pins sim_constant_1/dout] [get_bd_pins ex_mem_reg/flush]
connect_bd_net -net ex_pc_plus4_1 [get_bd_pins id_ex_reg/ex_pc_plus4] [get_bd_pins ex_mem_reg/ex_pc_plus4]
connect_bd_net -net ex_imm_u_1 [get_bd_pins id_ex_reg/ex_imm_u] [get_bd_pins ex_mem_reg/ex_imm_u]
connect_bd_net -net ex_mem_we_1 [get_bd_pins id_ex_reg/ex_mem_we] [get_bd_pins ex_mem_reg/ex_mem_we]
connect_bd_net -net ex_mem_size_1 [get_bd_pins id_ex_reg/ex_mem_size] [get_bd_pins ex_mem_reg/ex_mem_size]
connect_bd_net -net ex_mem_unsigned_1 [get_bd_pins id_ex_reg/ex_mem_unsigned] [get_bd_pins ex_mem_reg/ex_mem_unsigned]
connect_bd_net -net ex_rd_we_1 [get_bd_pins id_ex_reg/ex_rd_we] [get_bd_pins ex_mem_reg/ex_rd_we]
connect_bd_net -net ex_wb_sel_1 [get_bd_pins id_ex_reg/ex_wb_sel] [get_bd_pins ex_mem_reg/ex_wb_sel]
connect_bd_net [get_bd_pins regfile_0/rs1_rdata] [get_bd_pins id_ex_reg/id_rs1_data]
connect_bd_net [get_bd_pins regfile_0/rs2_rdata] [get_bd_pins id_ex_reg/id_rs2_data]
connect_bd_net [get_bd_pins control_0/imm_sel] [get_bd_pins imm_mux_0/imm_sel]
connect_bd_net [get_bd_pins decoder_0/imm_i] [get_bd_pins imm_mux_0/imm_i]
connect_bd_net [get_bd_pins decoder_0/imm_s] [get_bd_pins imm_mux_0/imm_s]
connect_bd_net [get_bd_pins decoder_0/imm_b] [get_bd_pins imm_mux_0/imm_b]
connect_bd_net [get_bd_pins decoder_0/imm_u] [get_bd_pins imm_mux_0/imm_u] [get_bd_pins id_ex_reg/id_imm_u]
connect_bd_net [get_bd_pins decoder_0/imm_j] [get_bd_pins imm_mux_0/imm_j]
connect_bd_net [get_bd_pins imm_mux_0/imm_out] [get_bd_pins id_ex_reg/id_imm]
connect_bd_net -net RV32I_IF_id_instr_out [get_bd_pins if_id_reg_0/id_instr_out] [get_bd_pins id_ex_reg/id_instr] [get_bd_pins decoder_0/instr]
connect_bd_net -net RV32I_IF_id_pc_out [get_bd_pins if_id_reg_0/id_pc_out] [get_bd_pins id_ex_reg/id_pc]
connect_bd_net -net RV32I_IF_id_pc4_out [get_bd_pins if_id_reg_0/id_pc4_out] [get_bd_pins id_ex_reg/id_pc_plus4]
connect_bd_net -net RV32I_IF_id_pred_next_pc_out [get_bd_pins if_id_reg_0/id_pred_next_pc_out] [get_bd_pins id_ex_reg/id_pred_next_pc]
connect_bd_net [get_bd_pins decoder_0/rd] [get_bd_pins id_ex_reg/id_rd]
connect_bd_net [get_bd_pins control_0/alu_op] [get_bd_pins id_ex_reg/id_alu_op]
connect_bd_net [get_bd_pins control_0/op_a_sel] [get_bd_pins id_ex_reg/id_op_a_sel]
connect_bd_net [get_bd_pins control_0/op_b_sel] [get_bd_pins id_ex_reg/id_op_b_sel]
connect_bd_net [get_bd_pins control_0/branch_en] [get_bd_pins id_ex_reg/id_branch_en]
connect_bd_net [get_bd_pins control_0/branch_funct3] [get_bd_pins id_ex_reg/id_branch_funct3]
connect_bd_net [get_bd_pins control_0/jal] [get_bd_pins id_ex_reg/id_jal]
connect_bd_net [get_bd_pins control_0/jalr] [get_bd_pins id_ex_reg/id_jalr]
connect_bd_net [get_bd_pins control_0/mem_re] [get_bd_pins id_ex_reg/id_mem_re]
connect_bd_net [get_bd_pins control_0/mem_we] [get_bd_pins id_ex_reg/id_mem_we]
connect_bd_net [get_bd_pins control_0/mem_size] [get_bd_pins id_ex_reg/id_mem_size]
connect_bd_net [get_bd_pins control_0/mem_sign_ext] [get_bd_pins id_ex_reg/id_mem_unsigned]
connect_bd_net [get_bd_pins control_0/rd_we] [get_bd_pins id_ex_reg/id_rd_we]
connect_bd_net [get_bd_pins control_0/wb_sel] [get_bd_pins id_ex_reg/id_wb_sel]
connect_bd_net [get_bd_pins decoder_0/illegal_opcode] [get_bd_pins id_ex_reg/id_illegal_instr]
connect_bd_net [get_bd_pins decoder_0/opcode] [get_bd_pins control_0/opcode]
connect_bd_net [get_bd_pins decoder_0/funct3] [get_bd_pins control_0/funct3]
connect_bd_net [get_bd_pins decoder_0/funct7] [get_bd_pins control_0/funct7]
connect_bd_net [get_bd_pins decoder_0/fmt] [get_bd_pins control_0/fmt]
connect_bd_net [get_bd_pins decoder_0/bit30] [get_bd_pins control_0/bit30]
connect_bd_net [get_bd_pins pc_unit_0/pc] \
  [get_bd_pins pc_to_imem_addr_0/pc] [get_bd_pins branch_predictor_btb_0/if_pc] [get_bd_pins if_id_reg_0/if_pc_in]
connect_bd_net [get_bd_pins pc_to_imem_addr_0/addr] [get_bd_pins rom_memory_0/addr]
connect_bd_net [get_bd_pins branch_predictor_btb_0/pred_valid] [get_bd_pins util_vector_and_2/Op1]
connect_bd_net [get_bd_pins branch_predictor_btb_0/pred_taken] [get_bd_pins util_vector_and_2/Op2]
connect_bd_net [get_bd_pins branch_predictor_btb_0/pred_next_pc] [get_bd_pins pc_unit_0/pc_predict_next] [get_bd_pins if_id_reg_0/if_pred_next_pc_in]
connect_bd_net [get_bd_pins pc_unit_0/pc_plus4] [get_bd_pins if_id_reg_0/if_pc4_in]
connect_bd_net [get_bd_pins rom_memory_0/dout] [get_bd_pins if_id_reg_0/if_instr_in]
connect_bd_net [get_bd_pins util_vector_or_0/Res] [get_bd_pins if_id_reg_0/flush]
connect_bd_net -net util_vector_logic_7_Res [get_bd_pins util_vector_or_1/Res] [get_bd_pins util_vector_not_1/Op1] [get_bd_pins if_id_reg_0/hold]
connect_bd_net -net util_vector_and_1_Res_1 [get_bd_pins util_vector_and_3/Res] [get_bd_pins pc_unit_0/pc_en]
connect_bd_net -net util_vector_and_0_Res_1 [get_bd_pins util_vector_and_2/Res] [get_bd_pins pc_unit_0/pc_predict_valid]
connect_bd_net -net util_vector_not_0_Res_1 [get_bd_pins util_vector_not_2/Res] [get_bd_pins util_vector_and_3/Op2]
connect_bd_net [get_bd_pins util_vector_not_1/Res] [get_bd_pins rom_memory_0/en]
connect_bd_net [get_bd_pins uart_tx_0/tx] [get_bd_pins uart_tx_0/rx]
connect_bd_net [get_bd_pins sim_constant_2/dout] [get_bd_pins if_id_reg_0/if_valid_in]

validate_bd_design
save_bd_design
